# EAGLE design 606_motor_ichigojam (EAGLE 9.6.2)
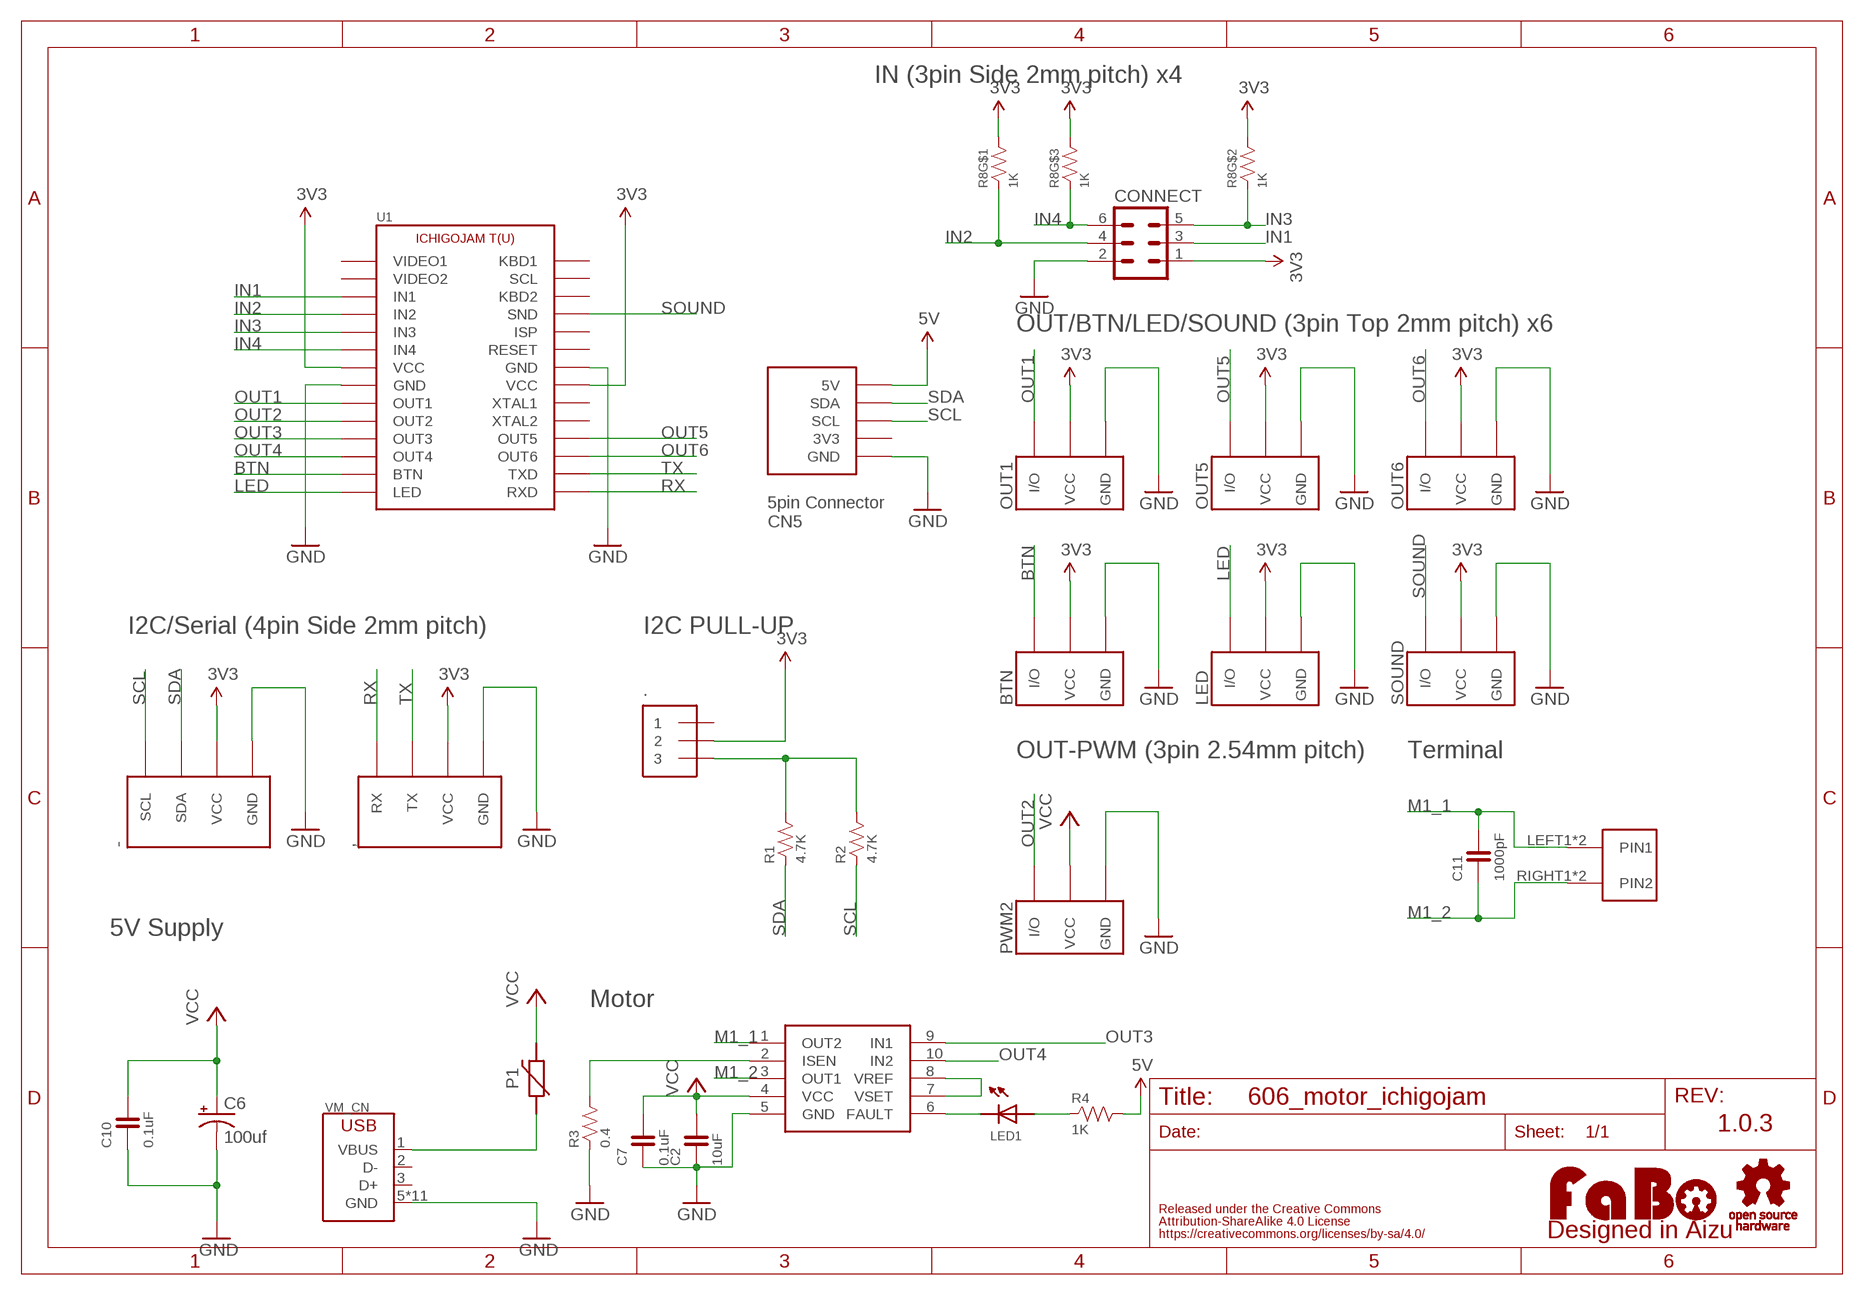
[diagram p0: schematic, sheet 1]

## Parts
,  FABO_BRICK_SERIAL-S04B-PASK-2_LONG  [FABO_BRICK_SERIAL_S04B-PASK-2_LONG]
-  FABO_BRICK_I2C-S04B-PASK-2_LONG  [FABO_BRICK_I2C_S04B-PASK-2_LONG]
.  PIN_HEADER_1X3  [PIN_1X3]
BTN  FABO_BRICK_3PIN-B03B-PASK-1  [FABO_BRICK_3PIN_B03B-PASK-1]
C2  10uF  CAPACITOR-0603  [0603]
C6  100uf  CPOL-US153CLV-0405  [153CLV-0405]
C7  0.1uF  CAPACITOR-0603  [0603]
C10  0.1uF  CAPACITOR-0603  [0603]
C11  1000pF  CAPACITOR-0603  [0603]
CONNECT  MA03-2  [MA03-2]
LED  FABO_BRICK_3PIN-B03B-PASK-1  [FABO_BRICK_3PIN_B03B-PASK-1]
LED1  LED-0603  [0603]
LOGO1  LOGO_FABO-M  [LOGO_FABO_M]
OUT1  FABO_BRICK_3PIN-B03B-PASK-1  [FABO_BRICK_3PIN_B03B-PASK-1]
OUT5  FABO_BRICK_3PIN-B03B-PASK-1  [FABO_BRICK_3PIN_B03B-PASK-1]
OUT6  FABO_BRICK_3PIN-B03B-PASK-1  [FABO_BRICK_3PIN_B03B-PASK-1]
P1  POLYSWITCHMF-NSML1  [1206]
PWM2  FABO_BRICK_3PIN-HEADER  [FABO_BRICK_3PIN_HEADER]
R1  4.7K  RESISTOR-0603  [0603]
R2  4.7K  RESISTOR-0603  [0603]
R3  0.4  RESISTOR-0603  [0603]
R4  1K  RESISTOR-0603  [0603]
R8  1K  RESISTOR_ARRAY  [EXBV8V]
SOUND  FABO_BRICK_3PIN-B03B-PASK-1  [FABO_BRICK_3PIN_B03B-PASK-1]
U1  ICHIGOJAM_T-NOLABEL  [ICHIGOJAM_T_NOLABEL]
U$2  LOGO_OSHW-M_BOTTOM  [LOGO_OSHW_M_BOTTOM]
U$6  DRV8832  [DRV8830]
U$12  ML-1400-S1  [ML-1400-S1]
VM_CN  USB-ZX62D  [ZX62D-B-5PA8]

## Nets
3V3: ,.VCC -.VCC ..2 BTN.VCC CONNECT.1 LED.VCC OUT1.VCC OUT5.VCC OUT6.VCC R8.6 R8.7 R8.8 SOUND.VCC U1.VCC1(VCC) U1.VCC2(VCC)
5V: R4.2 U1.5V
BTN: BTN.I/O U1.BTN
GND: ,.GND -.GND BTN.GND C2.1 C6.- C7.1 C10.1 CONNECT.2 LED.GND OUT1.GND OUT5.GND OUT6.GND PWM2.GND R3.1 SOUND.GND U1.GND1(GND) U1.GND2(GND) U1.GND3(GND) U$6.5(GND) VM_CN.5(GND) VM_CN.B1(GND) VM_CN.B2(GND) VM_CN.B3(GND) VM_CN.B4(GND) VM_CN.T1(GND) VM_CN.T2(GND) VM_CN.T3(GND) VM_CN.T4(GND) VM_CN.T5(GND) VM_CN.T6(GND)
GPIO21: LED1.CATHODE U$6.6(FAULT)
IN1: CONNECT.3 U1.IN1
IN2: CONNECT.4 R8.1 U1.IN2
IN3: CONNECT.5 R8.2 U1.IN3
IN4: CONNECT.6 R8.3 U1.IN4
LED: LED.I/O U1.LED
M1_1: C11.2 U$6.1(OUT2) U$12.LEFT1(PIN1) U$12.LEFT2(PIN1)
M1_2: C11.1 U$6.3(OUT1) U$12.RIGHT1(PIN2) U$12.RIGHT2(PIN2)
N$1: ..3 R1.2 R2.2
N$2: R3.2 U$6.2(ISEN)
N$3: U$6.7(VSET) U$6.8(VREF)
N$4: LED1.ANODE R4.1
N$11: P1.P$1 VM_CN.1(VBUS)
OUT1: OUT1.I/O U1.OUT1
OUT2: PWM2.I/O U1.OUT2
OUT3: U1.OUT3 U$6.9(IN1)
OUT4: U1.OUT4 U$6.10(IN2)
OUT5: OUT5.I/O U1.OUT5
OUT6: OUT6.I/O U1.OUT6
RX: ,.RX U1.RXD
SCL: -.SCL R2.1 U1.SCL2(SCL)
SDA: -.SDA R1.1 U1.SDA
SOUND: SOUND.I/O U1.SND
TX: ,.TX U1.TXD
VCC: C2.2 C6.+ C7.2 C10.2 P1.P$2 PWM2.VCC U$6.4(VCC)
Unconnected: ..1 R8.4 R8.5 U1.3V3 U1.ISP U1.KBD1 U1.KBD2 U1.RST(RESET) U1.SCL1(SCL) U1.VIDEO1 U1.VIDEO2 U1.XTAL1 U1.XTAL2 VM_CN.2(D-) VM_CN.3(D+)

## Notes on the sheet
- IN (3pin Side 2mm pitch) x4
- OUT/BTN/LED/SOUND (3pin Top 2mm pitch) x6
- 5pin Connector
  CN5
- I2C/Serial (4pin Side 2mm pitch) | I2C PULL-UP
- OUT-PWM (3pin 2.54mm pitch) | Terminal
- 5V Supply
- Motor
- 1.0.3

## Library data of the parts
, = FaBo-Template:FABO_BRICK_SERIAL: FaBo Brick Serial
- = FaBo-Template:FABO_BRICK_I2C: FaBo Brick I2C
. = FaBo-PIN:PIN_HEADER_1X3
BTN LED OUT1 OUT5 OUT6 PWM2 SOUND = FaBo-Template:FABO_BRICK_3PIN: FaBo Brick 3pin
C2 C7 C10 C11 = FaBo-Capacitor:CAPACITOR: CAPACITOR
C6 = resistor:CPOL-US: POLARIZED CAPACITOR, American symbol
CONNECT = con-lstb:MA03-2: PIN HEADER; OC_FARNELL: unknown; OC_NEWARK: unknown
LED1 = FaBo-LED:LED
LOGO1 = component:LOGO_FABO
P1 = FaBo-Supply:POLYSWITCH
R1-R4 = FaBo-Resistors:RESISTOR: RESISTOR
R8 = component:RESISTOR_ARRAY
U1 = FaBo-Boards:ICHIGOJAM_T
U$2 = component:LOGO_OSHW
U$6 = FaBo-Motor:DRV8832
U$12 = FaBo-Terminal:ML-1400-S1
VM_CN = component:USB

## Board
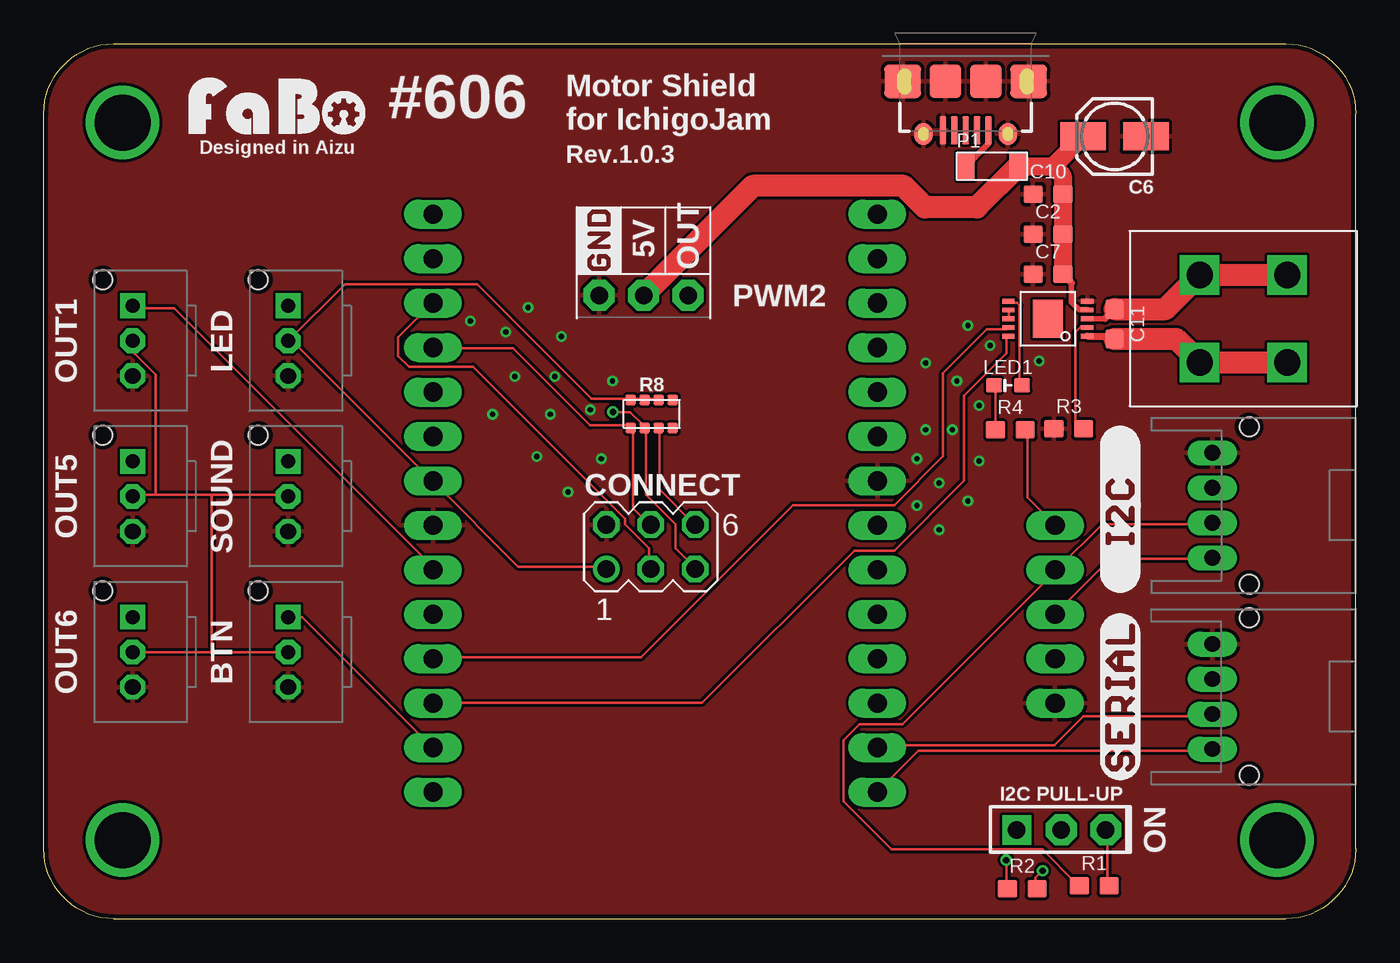
[diagram p1: board, top side]
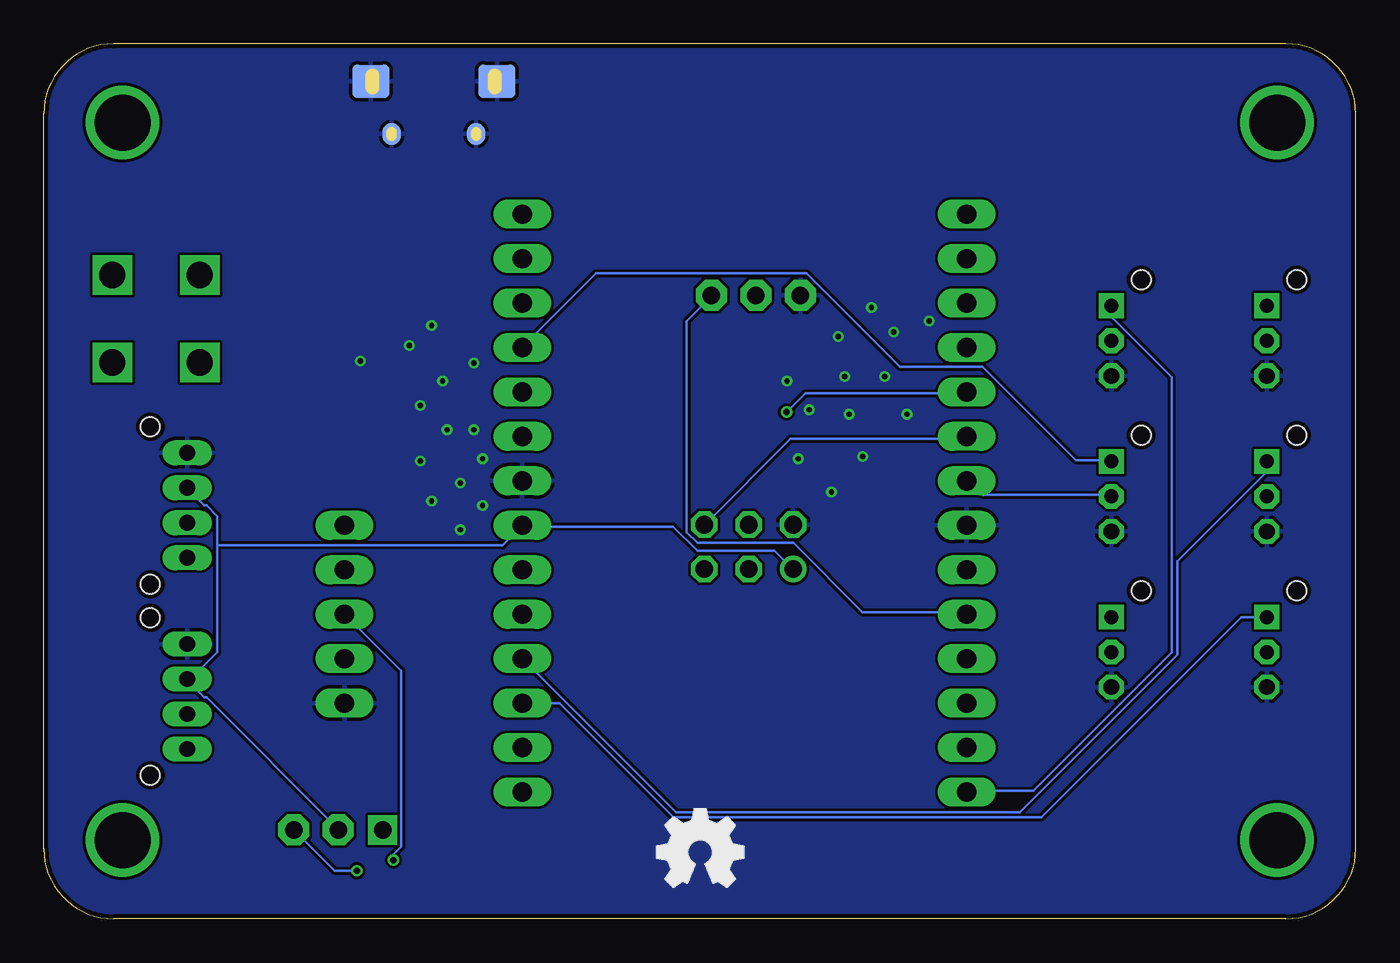
[diagram p2: board, bottom side, seen from below]

Size 75 x 50 mm. Coordinates in mm from the lower left corner, seen from the top.
Copper layers (1*16): Top 0.035mm / dielectric 1.6mm / Bottom 0.035mm
Design rules "PCBway": minimum track width 6mil, minimum drill 12mil, track to track 6mil, track to pad 6mil, pad to pad 6mil, via to via 6mil, smd to smd 6mil, copper to edge 10mil, drill to drill 10mil, minimum pad ring 10mil, minimum via ring 6mil, stop-mask expansion 2mil, vias tented up to drill 100mil, thermal gap 8mil

### Footprints (pad centres in the part's own frame; a part is rotated, then mirrored left to right if it is on the bottom)
FABO_BRICK_SERIAL_S04B-PASK-2_LONG = drill 0.9 pad 1.422 long: GND -3,0; RX 3,0; TX 1,0; VCC -1,0 | hole 1.1: 4.5,2.1; -4.5,2.1
FABO_BRICK_I2C_S04B-PASK-2_LONG = drill 0.9 pad 1.422 long: GND -3,0; SCL 3,0; SDA 1,0; VCC -1,0 | hole 1.1: 4.5,2.1; -4.5,2.1
PIN_1X3 = drill 1 pad 1.676 square: 1 -2.54,0 | drill 1 pad 1.778 octagon: 2 0,0; 3 2.54,0
FABO_BRICK_3PIN_B03B-PASK-1 = drill 0.9 pad 1.422 octagon: GND -2,0 | drill 0.8 pad 1.422 square: I/O 2,0 | drill 0.8 pad 1.422 octagon: VCC 0,0 | hole 1.1: 3.5,1.7
0603 = smd 1.1 x 1: 1 -0.85,0; 2 0.85,0
153CLV-0405 = smd 2.6 x 1.6: + 1.8,0; - -1.8,0
MA03-2 = drill 1.016: 1 -2.54,-1.27 | drill 1.016 octagon: 2 -2.54,1.27; 3 0,-1.27; 4 0,1.27; 5 2.54,-1.27; 6 2.54,1.27
0603' = smd 0.9 x 0.8: ANODE -0.8,0; CATHODE 0.8,0
1206 = smd 1 x 1.6: P$1 -1.5,0; P$2 1.5,0
FABO_BRICK_3PIN_HEADER = drill 1 pad 1.778 octagon: GND -2.54,0; I/O 2.54,0; VCC 0,0
EXBV8V = smd 0.6 x 0.6: 1 -1.2,-0.8; 2 -0.4,-0.8; 3 0.4,-0.8; 4 1.2,-0.8; 5 1.2,0.8; 6 0.4,0.8; 7 -0.4,0.8; 8 -1.2,0.8
ICHIGOJAM_T_NOLABEL = drill 1.1 long: 3V3 57.81,14.86; 5V 57.81,22.48; BTN 22.25,9.78; GND1 22.25,22.48; GND2 47.65,25.02; GND3 57.81,12.32; IN1 22.25,35.18; IN2 22.25,32.64; IN3 22.25,30.1; IN4 22.25,27.56; ISP 47.65,30.1; KBD1 47.65,40.26; KBD2 47.65,35.18; LED 22.25,7.24; OUT1 22.25,19.94; OUT2 22.25,17.4; OUT3 22.25,14.86; OUT4 22.25,12.32; OUT5 47.65,14.86; OUT6 47.65,12.32; RST 47.65,27.56; RXD 47.65,7.24; SCL1 47.65,37.72; SCL2 57.81,17.4; SDA 57.81,19.94; SND 47.65,32.64; TXD 47.65,9.78; VCC1 22.25,25.02; VCC2 47.65,22.48; VIDEO1 22.25,40.26; VIDEO2 22.25,37.72; XTAL1 47.65,19.94; XTAL2 47.65,17.4 | drill 3.2: P$1 4.5,45.5; P$2 70.5,45.5; P$3 70.5,4.5; P$4 4.5,4.5
DRV8830 = smd 0.27 x 0.7: 1 -1,-2.24; 2 -0.5,-2.24; 3 0,-2.24; 4 0.5,-2.24; 5 1,-2.24; 6 1,2.26; 7 0.5,2.26; 8 0,2.26; 9 -0.5,2.26; 10 -1,2.26 | smd 2.18 x 1.72: P$1 0,0
ML-1400-S1 = drill 1.5 square: LEFT1 -2.5,2.5; LEFT2 -2.5,-2.5; RIGHT1 2.5,2.5; RIGHT2 2.5,-2.5
ZX62D-B-5PA8 = smd 0.4 x 1.6: 1 -1.3,4.25; 2 -0.65,4.25; 3 0,4.25; 4 0.65,4.25; 5 1.3,4.25 | smd 1.05 x 1.25 bottom: B1 -2.425,4.45; B2 2.425,4.45 | smd 2.1 x 1.9 bottom: B3 -3.6,1.45; B4 3.6,1.45 | smd 1.05 x 1.25: T1 -2.425,4.45; T2 2.425,4.45 | smd 2.1 x 1.9: T3 -3.6,1.45; T6 3.6,1.45 | smd 1.8 x 1.9: T4 -1.15,1.45; T5 1.15,1.45

### Placement (x,y rotation side)
,  66.8,12.7 270 top
-  66.8,23.62 270 top
.  58.17,5.08 0 top
BTN  13.97,15.24 90 top
C2  57.4,39.12 0 top
C6  61.21,44.7 180 top
C7  57.4,36.83 0 top
C10  57.4,41.4 0 top
C11  61.21,33.99 270 top
CONNECT  34.7,21.25 0 top
LED  13.97,33.02 90 top
LED1  [0603']  55.12,30.48 0 top
LOGO1  13.34,44.45 0 top
OUT1  5.08,33.02 90 top
OUT5  5.08,24.13 90 top
OUT6  5.08,15.24 90 top
P1  54.2,43 0 top
PWM2  34.29,35.62 0 top
R1  60.04,1.88 0 top
R2  55.93,1.73 0 top
R3  58.6,27.99 0 top
R4  55.24,27.94 0 top
R8  34.75,28.85 0 top
SOUND  13.97,24.13 90 top
U1  0,0 0 top
U$2  37.47,3.81 0 top
U$4  [LOGO_SILK_SERIAL2]  62.7,12.7 90 top
U$5  [LOGO_SILK_I2C]  62.7,23.4 90 top
U$6  57.4,34.29 90 top
U$7  [LOGO_SILK_GND]  33.01,36.85 90 top
U$12  68.58,34.29 90 top
VM_CN  52.7,49.3 180 top

### Tracks (layer width: path | path; a pad name or v marks a point on that pad's centre or on a via)
3V3
  Top 0.152: BTN.VCC 9.6,15.24 | 9.6,15.24 OUT6.VCC | 9.6,24.23 13.87,24.23 SOUND.VCC | 9.6,24.23 6.4,24.23 | 6.4,24.23 5.18,24.23 OUT5.VCC | 6.4,24.23 6.4,31.09 5.18,32.31 5.18,32.92 OUT1.VCC | 9.6,24.23 9.6,15.24 | R8.6 35.05,29.72 34.44,29.72 R8.7 34.29,29.72 33.68,29.72 R8.8 33.53,29.72 31.32,29.72 24.77,36.27 17.22,36.27 LED.VCC 14.02,32.92 14.33,32.92 22.1,25.15 U1.VCC1 22.25,24.99 27.13,20.12 32.16,20.12 CONNECT.1
  Bottom 0.152: 66.75,13.56 65.84,12.65 65.68,12.65 58.22,5.18 ..2 | 65.08,21.34 65.08,15.24 66.75,13.56 | 65.08,21.34 65.08,23.01 65.68,23.62 65.84,23.62 66.75,24.54 -.VCC | 66.75,13.56 ,.VCC | CONNECT.1 32.31,20.12 33.22,21.03 37.64,21.03 39.01,22.4 47.55,22.4 U1.VCC2 47.7,22.4 48.77,21.34 65.08,21.34 | SOUND.VCC 14.02,24.23 21.34,24.23 22.1,24.99 U1.VCC1
5V
  Top 0.152: R4.2 56.24,27.89 56.24,24.08 57.76,22.55 U1.5V
BTN
  Top 0.152: BTN.I/O 14.02,17.22 14.78,17.22 22.1,9.91 U1.BTN
GND  (via drill 0.3)
  other vias: 54.1,32.77 52.83,33.91 56.9,31.88 52.2,30.73 51.94,27.94 53.47,29.34 50.42,27.94 49.91,26.29 49.91,23.62 51.18,24.89 51.18,22.23 52.83,23.88 53.47,26.16 50.42,31.75 31.88,26.29 28.96,28.83 31.24,29.08 29.21,30.99 26.42,33.53 24.38,34.16 26.92,30.99 28.19,26.42 25.65,28.83 27.69,34.92 29.59,33.27 32.51,30.73 29.97,24.38
  pour Bottom: 0,0 0,50.8 74.93,50.8 74.93,0
  pour Top: 0,0 0,50.8 74.93,50.8 74.93,0
GPIO21
  Top 0.152: U$6.6 55.17,35.2 55.63,35.2 55.78,35.05 55.78,30.48 LED1.CATHODE
IN1
  Top 0.152: CONNECT.3 34.59,20.12 34.59,21.18 33.22,22.55 33.22,22.86 24.54,31.55 20.88,31.55 20.27,32.16 20.27,33.22 22.1,35.05 U1.IN1
IN2
  Top 0.152: CONNECT.4 34.59,22.55 33.68,23.47 33.68,28.04 R8.1 33.53,28.19 31.24,28.19 26.82,32.61 22.25,32.61 U1.IN2
IN3  (via drill 0.35)
  Top 0.152: CONNECT.5 37.19,20.12 36.12,21.18 36.12,22.55 34.44,24.23 34.44,28.04 R8.2 34.29,28.19 33.53,28.96 v32.54,28.96
  Bottom 0.152: v32.54,28.96 31.47,30.02 22.25,30.02 U1.IN3
IN4
  Top 0.152: R8.3 35.2,28.04 35.2,24.54 37.19,22.55 CONNECT.6
  Bottom 0.152: U1.IN4 22.25,27.43 32.31,27.43 37.19,22.55 CONNECT.6
LED
  Bottom 0.152: LED.I/O 13.87,34.9 13.87,34.29 10.52,30.94 10.52,15.24 18.44,7.32 22.1,7.32 U1.LED
M1_1
  Top 0.406: U$6.1 61.06,33.29 C11.2
  Top 1.27: C11.2 64.73,33.13 U$12.LEFT1 U$12.LEFT2
M1_2
  Top 0.305: U$6.3 60.67,34.29
  Top 0.406: 60.67,34.29 C11.1
  Top 1.27: C11.1 64.12,34.84 U$12.RIGHT1 U$12.RIGHT2
N$1  (via drill 0.35)
  Top 0.152: v57.1,2.74 56.69,2.34 56.69,1.83 R2.2 | R1.2 60.81,1.98 60.81,5.03 ..3
  Bottom 0.152: v57.1,2.74 58.37,2.74 ..3
N$2
  Top 0.152: U$6.2 59.59,33.83 59.28,33.83 58.98,33.53 58.98,28.5 59.44,28.04 R3.2
N$3
  Top 0.152: U$6.8 55.17,34.29 55.17,34.75 U$6.7
N$4
  Top 0.152: LED1.ANODE 54.41,30.48 54.41,28.04 R4.1
N$11
  Top 0.305: VM_CN.1 54,44.3 P1.P$1
OUT1
  Top 0.152: OUT1.I/O 5.18,34.9 7.47,34.9 22.1,20.27 22.1,19.96 U1.OUT1
OUT2
  Bottom 0.152: U1.OUT2 22.25,17.53 28.19,17.53 32.16,21.49 37.64,21.49 38.25,22.1 38.25,34.14 36.88,35.51 PWM2.I/O
OUT3
  Top 0.152: U$6.9 55.02,33.68 53.91,33.68 51.41,31.18 51.41,26.42 48.62,23.62 42.82,23.62 34.14,14.94 22.25,14.94 U1.OUT3
OUT4
  Top 0.152: U$6.10 55.02,33.22 55.02,32.31 52.6,29.9 52.6,25.02 48.62,21.03 46.33,21.03 37.64,12.34 22.25,12.34 U1.OUT4
OUT5
  Bottom 0.152: OUT5.I/O 5.18,26.06 5.18,25.45 10.21,20.42 10.21,15.09 19.2,6.1 38.86,6.1 47.55,14.78 U1.OUT5
OUT6
  Bottom 0.152: U1.OUT6 45.52,12.32 38.99,5.79 17.98,5.79 6.55,17.22 5.18,17.22 OUT6.I/O
RX
  Top 0.152: ,.RX 66.75,9.6 49.99,9.6 47.7,7.32 U1.RXD
SCL  (via drill 0.35)
  Top 0.152: v55.02,3.35 55.02,1.83 R2.1 | -.SCL 66.75,20.57 60.96,20.57 57.91,17.53 U1.SCL2
  Bottom 0.152: v55.02,3.35 55.02,3.66 54.56,4.12 54.56,14.17 57.76,17.37 U1.SCL2
SDA
  Top 0.152: R1.1 59.13,1.98 59.05,1.98 57.07,3.96 48.46,3.96 45.72,6.71 45.72,10.21 46.63,11.12 49.07,11.12 57.76,19.81 U1.SDA 57.91,19.96 60.5,22.55 66.75,22.55 -.SDA
SOUND
  Bottom 0.152: SOUND.I/O 14.02,26.21 16,26.21 21.34,31.55 26.06,31.55 31.39,36.88 43.43,36.88 47.55,32.77 U1.SND
TX
  Top 0.152: ,.TX 66.75,11.58 59.44,11.58 57.76,9.91 47.7,9.91 U1.TXD
VCC
  Top 0.305: U$6.4 59.19,34.79 58.75,35.23 58.75,36.33
  Top 0.406: 58.75,36.33 C7.2
  Top 1.016: P1.P$2 57.71,43 | 57.71,43 C6.+ | 57.71,43 58.25,42.46 C10.2 C2.2 C7.2
  Top 1.27: P1.P$2 53.35,40.65 50.37,40.65 49.14,41.87 40.54,41.87 PWM2.VCC

### Text on the board
tPlace: #606 | Motor Shield / for IchigoJam | Designed in Aizu | Rev.1.0.3 | 5V | OUT | I2C PULL-UP | ON